# Altium schematic sheet Peripherals.SchDoc
size A4; SheetNumber: 5; SheetTotal: 5
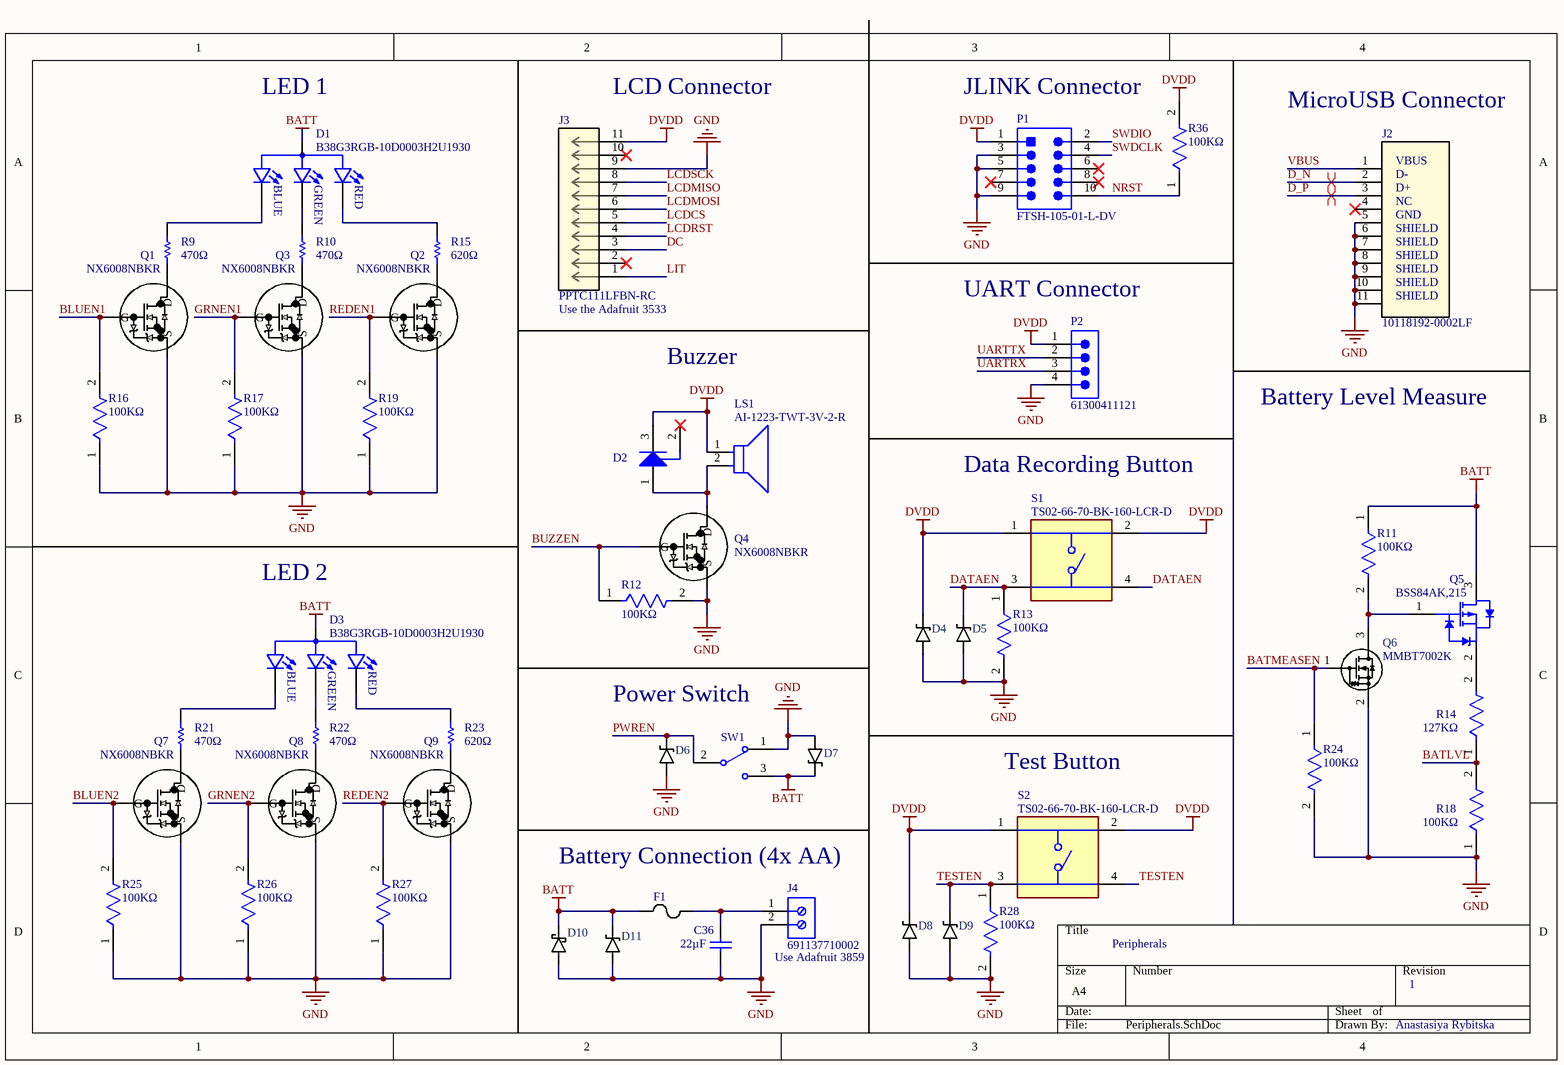
[diagram p0: Peripherals.SchDoc]

## Parts
C36  Capacitance: 22µF  [KEMT-1206-2_M]  (hidden comment: TCJA226M016R0300E)
D1  B38G3RGB-10D0003H2U1930  [LED_B38G3RGB-10D0003H2U1930]
D2  BAS16LT1G  [ONSC-SOT-23-3-318-08_V]  (value not drawn)
D3  B38G3RGB-10D0003H2U1930  [LED_B38G3RGB-10D0003H2U1930]
D4  ESD5Z3V3  [SOD-523]  (value not drawn)
D5  ESD5Z3V3  [SOD-523]  (value not drawn)
D6  ESD5Z3V3  [SOD-523]  (value not drawn)
D7  ESD5Z3V3  [SOD-523]  (value not drawn)
D8  ESD5Z3V3  [SOD-523]  (value not drawn)
D9  ESD5Z3V3  [SOD-523]  (value not drawn)
D10  SK16  [DO-214AC_SMA]  (value not drawn)
D11  ESD5Z3V3  [SOD-523]  (value not drawn)
F1  MFU0603FF02000P500  [FUS_VISHAY_MFU0603_VIS]  (value not drawn)
J2  10118192-0002LF  [CONN_10118192-0002LF_AMP]
J3  PPTC111LFBN-RC  [CONN11_PPPN111_SUL]
J4  691137710002  [691137710002]
LS1  AI-1223-TWT-3V-2-R  [FP-AI-1223-TWT-3V-2-R-MFG]
P1  FTSH-105-01-L-DV  [SMTC-FTSH-105-01-L-DV_V]
P2  61300411121  [61300411121]
Q1  NX6008NBKR  [NX6008NBKR_NEX]
Q2  NX6008NBKR  [NX6008NBKR_NEX]
Q3  NX6008NBKR  [NX6008NBKR_NEX]
Q4  NX6008NBKR  [NX6008NBKR_NEX]
Q5  BSS84AK,215  [NXP-SOT23_N]
Q6  MMBT7002K  [SOT-23]
Q7  NX6008NBKR  [NX6008NBKR_NEX]
Q8  NX6008NBKR  [NX6008NBKR_NEX]
Q9  NX6008NBKR  [NX6008NBKR_NEX]
R9  Resistance: 470Ω  [RESC1608X55X25NL10T15]  (hidden comment: RC0603FR-13470RL)
R10  Resistance: 470Ω  [RESC1608X55X25NL10T15]  (hidden comment: RC0603FR-13470RL)
R11  Resistance: 100KΩ  [FP-RMCF0603-IPC_C]  (hidden comment: RMCF0603FT100K)
R12  Resistance: 100KΩ  [FP-RMCF0603-IPC_C]  (hidden comment: RMCF0603FT100K)
R13  Resistance: 100KΩ  [FP-RMCF0603-IPC_C]  (hidden comment: RMCF0603FT100K)
R14  Resistance: 127KΩ  [FP-RT0603-MFG]  (hidden comment: RT0603FRE07127KL)
R15  Resistance: 620Ω  [RESC1608X55X25LL10T15]  (hidden comment: RC0603JR-07620RL)
R16  Resistance: 100KΩ  [FP-RMCF0603-IPC_C]  (hidden comment: RMCF0603FT100K)
R17  Resistance: 100KΩ  [FP-RMCF0603-IPC_C]  (hidden comment: RMCF0603FT100K)
R18  Resistance: 100KΩ  [FP-RMCF0603-IPC_C]  (hidden comment: RMCF0603FT100K)
R19  Resistance: 100KΩ  [FP-RMCF0603-IPC_C]  (hidden comment: RMCF0603FT100K)
R21  Resistance: 470Ω  [RESC1608X55X25NL10T15]  (hidden comment: RC0603FR-13470RL)
R22  Resistance: 470Ω  [RESC1608X55X25NL10T15]  (hidden comment: RC0603FR-13470RL)
R23  Resistance: 620Ω  [RESC1608X55X25LL10T15]  (hidden comment: RC0603JR-07620RL)
R24  Resistance: 100KΩ  [FP-RMCF0603-IPC_C]  (hidden comment: RMCF0603FT100K)
R25  Resistance: 100KΩ  [FP-RMCF0603-IPC_C]  (hidden comment: RMCF0603FT100K)
R26  Resistance: 100KΩ  [FP-RMCF0603-IPC_C]  (hidden comment: RMCF0603FT100K)
R27  Resistance: 100KΩ  [FP-RMCF0603-IPC_C]  (hidden comment: RMCF0603FT100K)
R28  Resistance: 100KΩ  [FP-RMCF0603-IPC_C]  (hidden comment: RMCF0603FT100K)
R36  Resistance: 100KΩ  [FP-RMCF0603-IPC_C]  (hidden comment: RMCF0603FT100K)
S1  TS02-66-70-BK-160-LCR-D  [SW_TS02-66-70-BK-160-LCR-D]
S2  TS02-66-70-BK-160-LCR-D  [SW_TS02-66-70-BK-160-LCR-D]
SW1  EG1218  [ESWI-EG1218_V]  (value not drawn)

## Nets
BATT: D1.3(A) D3.3(A) D7.K D10.K D11.K F1.1 Q5.3(D) R11.1 SW1.3
DVDD: D2.3(K) D4.K D8.K J3.11 LS1.1(C) P1.1 P2.1 R36.2 S1.1 S1.2 S2.1 S2.2
GND: C36.1 D4.A D5.A D6.A D7.A D8.A D9.A D10.A D11.A J2.5 J2.6 J2.7 J2.8 J2.9 J2.10 J2.11 J3.9 J4.2 P1.3 P1.5 P1.9 P2.4 Q1.2(S) Q2.2(S) Q3.2(S) Q4.2(S) Q6.2(S) Q7.2(S) Q8.2(S) Q9.2(S) R12.2 R13.2 R16.1 R17.1 R18.1 R19.1 R24.2 R25.1 R26.1 R27.1 R28.2 SW1.1
BATLVL: R14.1 R18.2
BATMEASEN: Q6.1(G) R24.1
BLUEN1: Q1.1(G) R16.2
BLUEN2: Q7.1(G) R25.2
BUZZEN: Q4.1(G) R12.1
D_N: J2.2
D_P: J2.3
DATAEN: D5.K R13.1 S1.3 S1.4
DC: J3.3
GRNEN1: Q3.1(G) R17.2
GRNEN2: Q8.1(G) R26.2
LCDCS: J3.5
LCDMISO: J3.7
LCDMOSI: J3.6
LCDRST: J3.4
LCDSCK: J3.8
LIT: J3.1
NRST: P1.10 R36.1
PWREN: D6.K SW1.2(COM)
REDEN1: Q2.1(G) R19.2
REDEN2: Q9.1(G) R27.2
SWDCLK: P1.4
SWDIO: P1.2
TESTEN: D9.K R28.1 S2.3 S2.4
UARTRX: P2.3
UARTTX: P2.2
VBUS: J2.1
NetC36_2: C36.2 F1.2 J4.1
NetD1_1: D1.1(G_C) R10.2
NetD1_2: D1.2(B_C) R9.2
NetD1_4: D1.4(R_C) R15.2
NetD2_1: D2.1(A) LS1.2(A) Q4.3(D)
NetD3_1: D3.1(G_C) R22.2
NetD3_2: D3.2(B_C) R21.2
NetD3_4: D3.4(R_C) R23.2
NetQ1_3: Q1.3(D) R9.1
NetQ2_3: Q2.3(D) R15.1
NetQ3_3: Q3.3(D) R10.1
NetQ5_1: Q5.1(G) Q6.3(D) R11.2
NetQ5_2: Q5.2(S) R14.2
NetQ7_3: Q7.3(D) R21.1
NetQ8_3: Q8.3(D) R22.1
NetQ9_3: Q9.3(D) R23.1

Not connected (* = marked no-connect by the designer): D2 2(NC)*; J2 4*; J3 2* 10*; P1 6* 7* 8*

## Layout directives
differential pair: D_N, D_P

## Notes on the sheet
- LED 1
- (near J3) LCD Connector
- JLINK Connector
- MicroUSB Connector
- (near J3) Use the Adafruit 3533
- (near P2) UART Connector
- Buzzer
- Battery Level Measure
- Data Recording Button
- LED 2
- Power Switch
- Test Button
- Battery Connection (4x AA)
- Peripherals
- Use Adafruit 3859
- 1
- Anastasiya Rybitska
- (in symbol 10118192-0002LF) VBUS; D-; D+; NC; GND; SHIELD
- (in symbol B38G3RGB-10D0003H2U1930) BLUE; GREEN; RED

## Library data of the parts
C36 = CMP-1037-04202-2: CAP TANT POLY 22UF 16V 1206; Manufacturer: Kemet; Voltage Rating: 50V; Product Range: KEMET-CSeries; SVHC: ToBeAdvised; Capacitance Tolerance: ±10%; Dielectric Characteristic: X7R; Capacitor Case Style: 1206[3216Metric]; Package Reference: 1206-2; Package Description: 2-Leads SMD, Body 3.2 x 1.6 mm; Packaging: Tape&Reel; Operating Temperature Max: 125degC; Datasheet URL: https://datasheet.ciiva.com/6125/1725438-6125494.pdf; Manufacturer URL: http://www.kemet.com/; Operating Temperature Min: -55degC; Datasheet Version: Jul-13
D1 D3 = B38G3RGB-10D0003H2U1930: Red, Green, Blue (RGB) - LED Indication - Discrete 2V Red, 3V Green, 3V Blue 0606 (1616 Metric); MF: Harvatek Corporation; Price: None; Purchase-URL: https://pricing.snapeda.com/search/part/B38G3RGB-10D0003H2U1930/?ref=eda; SnapEDA_Link: https://www.snapeda.com/parts/B38G3RGB-10D0003H2U1930/Harvatek/view-part/?ref=snap; Availability: In Stock; Value: *; MP: B38G3RGB-10D0003H2U1930; Package: None; Check_prices: https://www.snapeda.com/parts/B38G3RGB-10D0003H2U1930/Harvatek/view-part/?ref=eda
D2 = CMP-1054-00156-1: Switching Diode, 3-Pin SOT-23, Pb-Free, Tape and Reel; Manufacturer: On Semiconductor; trr Max (ns): 6; IF Max (A): 0.2; Configuration: Single; PackageVersion: Rev. AP, 11/2009; ComponentLink1Description: Manufacturer URL; ComponentLink2Description: Datasheet; Mounting Technology: Surface Mount; PartNumber: BAS16LT1G; ComponentLink3URL: http://www.onsemi.cn/pub_link/Collateral/318-08.PDF; ComponentLink3Description: Package Specification; PackageReference: SOT-23-3-318-08; DatasheetVersion: Rev. 10; ComponentLink1URL: http://www.onsemi.com/; PackageDescription: 3-Pin Small Outline Transistor, Body 2.92 x 1.3 mm, Pitch 0.95 mm; ComponentLink2URL: http://www.onsemi.com/pub_link/Collateral/BAS16LT1-D.PDF; Packing: Tape and Reel; RoHS: TRUE
D4-D9 D11 = ESD5Z3V3: ki_keywords: Zener TVS unidirectional Diode; ki_description: Zener Diode, TVS-unidirectional Diode; Datasheet: https://diotec.com/de/produktliste/Z.html
D10 = SK16: ki_keywords: Schottky; ki_description: Schottky Diode; Datasheet: https://diotec.com/de/produktliste/SBD.html
F1 = MFU0603FF02000P500: No Description Available; Mfr_Name: Vishay; Type: DEV; Copyright: Copyright (C) 2024 Ultra Librarian. All rights reserved.; Manufacturer_Part_Number: MFU0603FF02000P500; RefDes: RefDes
J2 = 10118192-0002LF: No Description Available; Mfr_Name: Amphenol ICC; Copyright: Copyright (C) 2024 Ultra Librarian. All rights reserved.; Manufacturer_Part_Number: 10118192-0002LF; RefDes: RefDes; Type: DEV
J3 = PPTC111LFBN-RC: No Description Available; Mfr_Name: Sullins; Type: DEV; Copyright: Copyright (C) 2023 Ultra Librarian. All rights reserved.; Manufacturer_Part_Number: PPTC111LFBN-RC; RefDes: RefDes
J4 = CMP-1502-03324-2: NexarPartId: 78871135; Voltage Rating: 300V; Number of Contacts: 2; Current Rating: 16A; Lead Pitch: 5mm; Height: 11.6mm; Packaging: Box; RoHS: Non-Compliant; Contact Material: Nickel, Tin; Max Operating Temperature: 120°C; Number of Pins: 2; Min Operating Temperature: -30°C; Number of Rows: 1
LS1 = CMP-103888-000003-1: BUZZER MAGNETIC 3V 12MM TH; Min Supply Voltage (DC): 2V; Operating Supply Current: 30mA; Max Supply Voltage (DC): 4V; Input Type: DC; Frequency: 2.3kHz; Series: AI; Nominal Supply Voltage (DC): 3V; Packaging: Tray; Max Operating Temperature: 70°C; Height: 7.5mm; Termination: PC Pins; Max Supply Current: 30mA; Mount: Through Hole; Diameter: 12mm; Voltage Rating: 3V; Sensing Method: Magnetic; Min Operating Temperature: -20°C; Contact Plating: Tin
P1 = CMP-2000-05354-1: CONN HEADER SMD 10POS 1.27MM (get from Garmin, or order cheaper); Manufacturer: Samtec; Connector Type: Header,Unshrouded; Pitch: 0.050"(1.27mm); Mating Products: FLE-105-01-G-DV-TR-ND-CONNSKT1.27MM10POSDUALSMDCLP-105-02-G-D-P-TR-ND-CONNRCPT10POSDUAL.05"SMDSFMC-105-L2-S-D-TR-ND-CONN.05"SURFACE10POSSMTSFMH-105-02-L-D-TR-ND-CONNRECEPT10POS.50"SMTFLE-105-01-G-DV-A-ND-CONNSKT1.27MM10POSDUALSMDCLP-105-02-G-D-BE-ND-CONNRCPT10POSDUAL.05"SMDFLE-105-01-G-DV-A-P-ND-CONNSKT1.27MM10POSDUALSMDSAM1153-05-ND-CONNRCPT10POSDUAL.05"SMDSAM1155-05-ND-CONNRCPT10POSDUAL.05"SMDSAM1154-05-ND-CONNRCPT10POSDUAL.05"SMDSFMH-105-02-L-D-LC-ND-CONNRECEPT10POS.50"SMTSAM1226-05-ND-CONNRCPT.05"10POSDUALSMD; Catalog Drawings: FTSHSeriesFTSHSeriesSMTSide; Other Names: SAM1161-05; EDA / CAD Models: DownloadfromAcceleratedDesigns; Number of Positions Loaded: All; Number of Positions: 10; Featured Product: Board-To-BoardInterconnectSystems; Online Catalog: FTSHSeries; Product Training Modules: Board-to-BoardConnectors; Category: Connectors,Interconnects; Number of Rows: 2; Contact Finish: Gold; Termination: Solder; Mounting Type: SurfaceMount; Series: FTSH; Contact Mating Length: 0.120"(3.05mm); Row Spacing: 0.050"(1.27mm); Datasheet URL: https://datasheet.ciiva.com/30493/0900766b80adfe36-30493006.pdf; Contact Finish Thickness: 10µin(0.25µm); Features: -; Standard Package: 1; Packaging: Bulk; Datasheet Version: Feb-08; Manufacturer URL: http://www.samtec.com/; Fastening Type: -; Family: RectangularConnectors-Headers,MalePins; Contact Type: MalePin; Color: Black
P2 = CMP-1502-01064-2: NexarPartId: 32855522; Pitch: 2.54mm; Number of Contacts: 4; Contact Resistance: 20mΩ; Gender: Male; Current Rating: 3A; Connector Type: Male Pin; Voltage Rating: 250V; Lead Free: Lead Free; Contact Plating: Gold; Max Operating Temperature: 105°C; Packaging: Bulk; Height: 8.89mm; Orientation: Vertical; Contact Mating Length: 5.9944mm; Contact Material: Copper; Lead Pitch: 2.54mm; Min Operating Temperature: -40°C; Termination: Solder; Color: Black; Number of Rows: 1; REACH SVHC: Unknown; RoHS: Compliant; Mount: Through Hole; Number of Positions: 4; Number of Pins: 4; Operating Supply Voltage: 250V
Q1-Q4 Q7-Q9 = NX6008NBKR: No Description Available; Mfr_Name: Nexperia; Type: DEV; Copyright: Copyright (C) 2023 Ultra Librarian. All rights reserved.; Manufacturer_Part_Number: NX6008NBKR; RefDes: RefDes
Q5 = CMP-1259-00086-1: P-Channel Trench MOSFET, -50 V, -0.18 A, -55 to 150 degC, 3-Pin SOT23, Tape and Reel; Manufacturer: NXP Semiconductors; Automotive Qualified: Y; Packing: Tape & Reel; Channel Type: P; VGSth [typ] (V): -1.6; IDM [max] (A): -0.7; Code_JEDEC: TO-236AB; DatasheetVersion: Rev. 1; ID [max] (A): -0.18; Mounting Technology: Surface Mount; ComponentLink3URL: http://www.nxp.com/documents/outline_drawing/sot023_po.pdf; ComponentLink1Description: Manufacturer URL; PackageVersion: 06-03-16, 03/2006; ComponentLink2Description: Datasheet; PackageReference: SOT23; VDS [max] (V): -50; PackageDescription: 3-Pin Small Outline Transistor Package, Body 2.9 x 1.3 mm, Pitch 0.95 mm; ComponentLink2URL: http://www.nxp.com/documents/data_sheet/BSS84AK.pdf; ComponentLink3Description: Package Specification; ComponentLink1URL: http://www.nxp.com/; PartNumber: BSS84AK,215
Q6 = MMBT7002K: ki_keywords: Power MOSFET N-MOS Gate Protected; ki_description: Symbol for Gate Protected N-Channel MOSFET; Datasheet: https://diotec.com/de/produktliste/FET.html
R9 R10 R21 R22 = CMP-2000-04220-1: Manufacturer: Yageo; Part Number: RC0603FR-13470RL
R11-R13 R16-R19 R24-R28 R36 = CMP-2000-06989-2: 100kΩ ±1% 0.1W 0603 Thick Film Chip Resistor AEC-Q200 compliant; Working Voltage: 75V; Max Power Dissipation: 100mW; Temperature Coefficient: 100ppm/°C; Height: 0.022inch; Construction: Rectangular; Lead Free: Lead Free; Tolerance: 1%; Features: Automotive AEC-Q200; Packaging: Tape and Reel; Number of Terminations: 2; Mount: Surface Mount; Case Code (Imperial): 0603; Case/Package: 0603; Resistor Type: Thick Film; Radiation Hardening: No; Power Rating: 100mW; Max Operating Temperature: 155°C; Length: 1.55mm; Width: 0.031inch; Military Standard: Not; RoHS Compliant: Yes; Min Operating Temperature: -55°C; Series: RMCF; Depth: 0.8mm; Case Code (Metric): 1608; Contact Plating: Tin
R14 = CMP-03412-001424-1: RES SMD 127K OHM 1% 1/10W 0603; Manufacturer: Yageo; Voltage Rating: 75V; Power Rating: 0.1W; Temperature Coefficient: 50 ppm/°C; Tolerance: 0.01; Value: 127KΩ; Temperature Range High: +155°C; Mouser Description: Thin Film Resistors - SMD 1/10W 127K ohm 1% 50ppm; Package: RT0603; Ipc Land Pattern Name: RESC16080X45; Lead Free: Yes; Temperature: -55°C to +155°C; Digikey Description: RES SMD 127K OHM 1% 1/10W 0603; Device Class L3: Chip SMD Resistors; Temperature Range Low: -55°C; Height: 0.55mm; Device Class L1: Passive Components; ComponentLink2Description: Datasheet; Series: RT; RoHS: TRUE; Automotive: No; Footprint Url: http://www.yageo.com/exep/pages/download/literatures/PYu-R_Mount_10.pdf; ComponentLink2URL: http://www.yageo.com/documents/recent/PYu-RT_1-to-0.01_RoHS_L_9.pdf; Device Class L2: Resistors; Composition: Thin Film; Manufacturer Part Number: RT0603FRE07127KL; Category: Res; Octopart: https://octopart.com/rt0603fre07127kl-yageo-1402897
R15 R23 = CMP-2000-04285-1: Manufacturer: Yageo; Part Number: RC0603JR-07620RL
S1 S2 = TS02-66-70-BK-160-LCR-D: 6 x 6 mm, 7 mm Actuator Height, 160 gf, Black, Long Crimped, Through Hole, SPST, Tactile Switch; MF: CUI Devices; Check_prices: https://www.snapeda.com/parts/TS02-66-70-BK-160-LCR-D/CUI+Devices/view-part/?ref=eda; CUI_purchase_URL: https://www.cuidevices.com/product/switches/tactile-switches/ts02-series?utm_source=snapeda.com&utm_medium=referral&utm_campaign=snapedaBOM; Package: None; Price: None; Value: *; MP: TS02-66-70-BK-160-LCR-D; Purchase-URL: https://pricing.snapeda.com/search/part/TS02-66-70-BK-160-LCR-D/?ref=eda; Availability: In Stock; SnapEDA_Link: https://www.snapeda.com/parts/TS02-66-70-BK-160-LCR-D/CUI+Devices/view-part/?ref=snap
SW1 = CMP-1696-00002-1: Slide Switch, 500 V, -20 to 70 degC, 3-Pin THD, RoHS; Case\Package: SOT-23-5; Output Current: 150 mA; Nominal Output Voltage: 3.3 V; Max Power Dissipation: 250 mW; Min Input Voltage: 4.3 V; Outputs: 1; Max Input Voltage: 8 V; Dropout Voltage: 300 mV; PackageDescription: 3-Pin Through Hole Device, Body 11.6 x 4 mm, Pitch 2.5 mm; ComponentLink1URL: http://www.e-switch.ch/en/; RoHSCompliant: true; Length: 3 mm; ComponentLink1Description: Manufacturer URL; Power Rating: 250 mW; Mount: Surface Mount; Max Operating Temperature: 85 degC; REACH SVHC: No SVHC; Radiation Hardening: No; Height: 1.3 mm; Pins: 5; Max Ouput Current: 150 mA; Output Voltage: 3.3 V; Width: 1.8 mm; Package Quantity: 3000; ComponentLink2URL: https://www.e-switch.com/system/asset/product_line/data_sheet/119/EG.pdf; Min Operating Temperature: -40 degC; ComponentLink2Description: Datasheet; DatasheetVersion: Oct-15; PackageReference: EG1218; Packaging: Tape and Reel